# Altium project Light_Control.PrjPcb
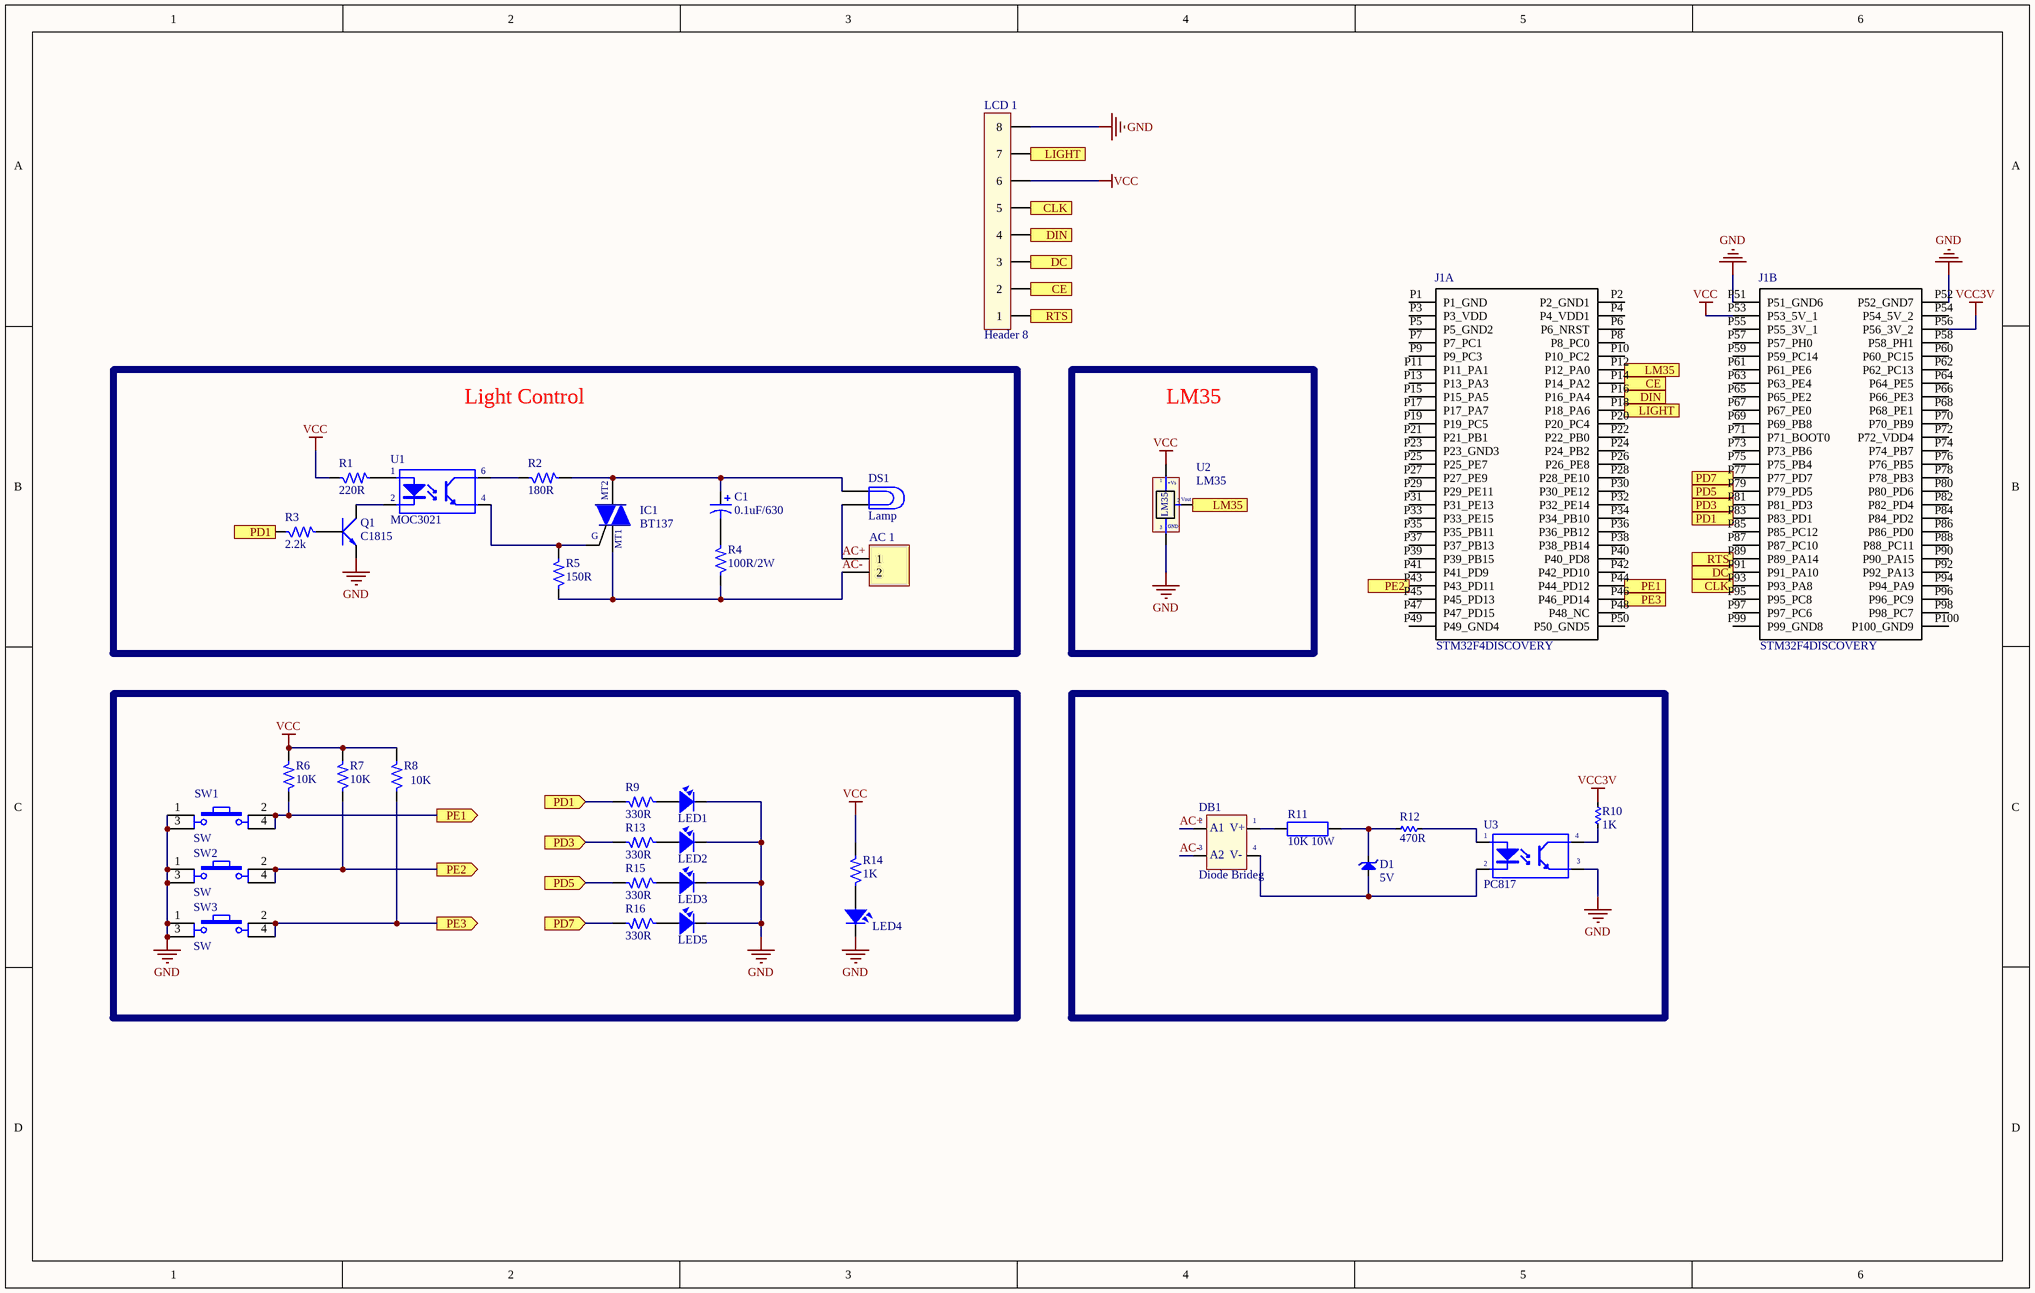
[diagram p0: Sheet1.SchDoc]
1 sheet, 36 parts. Net scope: flat (ports and power ports of the same name join across sheets).
Board file: PCB1.PcbDoc

## Sheet Sheet1.SchDoc
size B

### Parts
AC_1  Header 2  [DOMINO 2-5mm -H]  (value not drawn)
C1  value 0.1uF/630  [C-SE-22,5x26x20x11x4]
D1  5V  [DIO-0.5A-SMALL]
DB1  Diode Brideg  [DIO-Bri 5A]
DS1  Lamp  [DOMINO 2-5mm -H]
IC1  BT137  [TO220H2]
J1  STM32F4DISCOVERY  [STMICROELECTRONICS_STM32F4DISCOVERY_STM32F4DISCOVERY(Primary)]  (parts A,B of 2)
LCD_1  Header 8  [JP8]
LED1  LED  [LED_0805_Blue]  (value not drawn)
LED2  LED  [LED_0805_Blue]  (value not drawn)
LED3  LED  [LED_0805_Blue]  (value not drawn)
LED4  LED  [LED_0805_Blue]  (value not drawn)
LED5  LED  [LED_0805_Blue]  (value not drawn)
Q1  C1815  [QTO-92]
R1  220R  [RES-SM-0805]
R2  180R  [RES-SM-0805]
R3  2.2k  [RES-SM-0805]
R4  100R/2W  [R1W]
R5  150R  [RES-SM-0805]
R6  10K  [RES-SM-0805]
R7  10K  [RES-SM-0805]
R8  10K  [RES-SM-0805]
R9  330R  [RES-SM-0805]
R10  1K  [RES-SM-0805]
R11  10K 10W  [PCBComponent_1]
R12  470R  [RES-SM-0805]
R13  330R  [RES-SM-0805]
R14  1K  [RES-SM-0805]
R15  330R  [RES-SM-0805]
R16  330R  [RES-SM-0805]
SW1  SW  [SW4]
SW2  SW  [SW4]
SW3  SW  [SW4]
U1  MOC3021  [DIP6/W0.3]
U2  LM35  [QTO-92]
U3  PC817  [DIP4]

### Blocks framed on the sheet
Light Control: AC_1 C1 DS1 IC1 Q1 R1-R5 U1
LM35: U2

### Ports
CE (in), CE (out), CLK (in), CLK (out), DC (in), DC (out), DIN (in), DIN (out), LIGHT (in), LIGHT (out), LM35 (in), LM35 (out), PD1, PD1 (in), PD1 (out), PD3 (in), PD3 (out), PD5 (in), PD5 (out), PD7 (in), PD7 (out), PE1 (in), PE1 (out), PE2 (in), PE2 (out), PE3 (in), PE3 (out), RTS (in), RTS (out)

### Nets
GND: J1.P51(P51_GND6) J1.P52(P52_GND7) LCD_1.8 LED1.2 LED2.2 LED3.2 LED4.2 LED5.2 Q1.1(E) SW1.1 SW1.3 SW2.1 SW2.3 SW3.1 SW3.3 U2.3(-) U3.3(E)
VCC: J1.P53(P53_5V_1) LCD_1.6 R1.1 R6.2 R7.2 R8.2 R14.2 U2.1(+Vs)
VCC3V: J1.P56(P56_3V_2) R10.1
AC+: AC_1.1 DB1.2(AC1) DS1.2
AC-: AC_1.2 DB1.3(AC2) IC1.1(MT1) R4.1 R5.1
NetC1_1: C1.1 DS1.1 IC1.2(MT2) R2.2
NetC1_2: C1.2 R4.2
NetD1_1: D1.1(A) DB1.4(-V_OUT) U3.2(K)
NetD1_2: D1.2(K) R11.2 R12.2
NetDB1_1: DB1.1(+V_OUT) R11.1
NetIC1_3: IC1.3(IN) R5.2 U1.4(E)
NetJ1_P12: J1.P12(P12_PA0) U2.2(Vout) ; port LM35
NetJ1_P14: J1.P14(P14_PA2) LCD_1.2 ; port CE
NetJ1_P16: J1.P16(P16_PA4) LCD_1.4 ; port DIN
NetJ1_P18: J1.P18(P18_PA6) LCD_1.7 ; port LIGHT
NetJ1_P43: J1.P43(P43_PD11) R7.1 SW2.2 SW2.4 ; port PE2
NetJ1_P44: J1.P44(P44_PD12) R6.1 SW1.2 SW1.4 ; port PE1
NetJ1_P46: J1.P46(P46_PD14) R8.1 SW3.2 SW3.4 ; port PE3
NetJ1_P77: J1.P77(P77_PD7) R16.2 ; port PD7
NetJ1_P79: J1.P79(P79_PD5) R15.2 ; port PD5
NetJ1_P81: J1.P81(P81_PD3) R13.2 ; port PD3
NetJ1_P83: J1.P83(P83_PD1) R3.1 R9.2 ; port PD1
NetJ1_P89: J1.P89(P89_PA14) LCD_1.1 ; port RTS
NetJ1_P91: J1.P91(P91_PA10) LCD_1.3 ; port DC
NetJ1_P93: J1.P93(P93_PA8) LCD_1.5 ; port CLK
NetLED1_1: LED1.1 R9.1
NetLED2_1: LED2.1 R13.1
NetLED3_1: LED3.1 R15.1
NetLED4_1: LED4.1 R14.1
NetLED5_1: LED5.1 R16.1
NetQ1_2: Q1.2(C) U1.2(K)
NetQ1_3: Q1.3(B) R3.2
NetR1_2: R1.2 U1.1(A)
NetR2_1: R2.1 U1.6(C)
NetR10_2: R10.2 U3.4(C)
NetR12_1: R12.1 U3.1(A)

Not connected (* = marked no-connect by the designer): J1 P1(P1_GND) P2(P2_GND1) P3(P3_VDD) P4(P4_VDD1) P5(P5_GND2) P6(P6_NRST) P7(P7_PC1) P8(P8_PC0) P9(P9_PC3) P10(P10_PC2) P11(P11_PA1) P13(P13_PA3) P15(P15_PA5) P17(P17_PA7) P19(P19_PC5) P20(P20_PC4) P21(P21_PB1) P22(P22_PB0) P23(P23_GND3) P24(P24_PB2) P25(P25_PE7) P26(P26_PE8) P27(P27_PE9) P28(P28_PE10) P29(P29_PE11) P30(P30_PE12) P31(P31_PE13) P32(P32_PE14) P33(P33_PE15) P34(P34_PB10) P35(P35_PB11) P36(P36_PB12) P37(P37_PB13) P38(P38_PB14) P39(P39_PB15) P40(P40_PD8) P41(P41_PD9) P42(P42_PD10) P45(P45_PD13) P47(P47_PD15) P48(P48_NC) P49(P49_GND4) P50(P50_GND5) P54(P54_5V_2) P55(P55_3V_1) P57(P57_PH0) P58(P58_PH1) P59(P59_PC14) P60(P60_PC15) P61(P61_PE6) P62(P62_PC13) P63(P63_PE4) P64(P64_PE5) P65(P65_PE2) P66(P66_PE3) P67(P67_PE0) P68(P68_PE1) P69(P69_PB8) P70(P70_PB9) P71(P71_BOOT0) P72(P72_VDD4) P73(P73_PB6) P74(P74_PB7) P75(P75_PB4) P76(P76_PB5) P78(P78_PB3) P80(P80_PD6) P82(P82_PD4) P84(P84_PD2) P85(P85_PC12) P86(P86_PD0) P87(P87_PC10) P88(P88_PC11) P90(P90_PA15) P92(P92_PA13) P94(P94_PA9) P95(P95_PC8) P96(P96_PC9) P97(P97_PC6) P98(P98_PC7) P99(P99_GND8) P100(P100_GND9)

### Notes on the sheet
- Title
- Size:
- Date:
- B
- Number:
- Time:
- Revision:
- Sheet
- of
- File:
- (in symbol BT137) G
- (in symbol DIODE BRIGDE) A1; V+; A2; V-
- (in symbol LM35) GND

### Library data of the parts
AC_1 = Header 2: Header, 2-Pin; Manufacturer: Generic Components; Class: Connector; Value: Header 2
C1 = Cap Pol3: Polarized Capacitor (Surface Mount); VALUE: C?; LatestRevisionDate: 17-Jul-2002; LatestRevisionNote: Re-released for DXP Platform.; PackageReference: C0805; Publisher: Altium Limited
D1 = DIODE Zener: Zenner
DB1 = DIODE BRIGDE: Convert AC to DC voltage, 4 pin; Value: Cau 1A
DS1 = Lamp: Incandescent Bulb; Published: 24-Mar-1999; LatestRevisionDate: 17-Jul-2002; LatestRevisionNote: Re-released for DXP Platform.; PackageReference: PIN2; Publisher: Altium Limited
IC1 = BT137: Triacs - 8A; Value: LM317
J1 = STM32F4DISCOVERY: Development kit: ARM ST; pin strips, pin header; No.of; MF: STMicroelectronics; Price: None; SnapEDA_Link: https://www.snapeda.com/symbols-footprints/STM32F4DISCOVERY/STMicroelectronics/view-part/?ref=snap; Availability: Unavailable; MP: STM32F4DISCOVERY; Package: None; Value: *
LCD_1 = HED8V: Header 8 Vit Broad
LED1-LED5 = LED: LED Single colour Green and Red; Value: LED 3 ly Single Colour
Q1 = C1815: NPN 600mW, ECB; Value: C1815
R1-R9 R13-R16 = R: Resistor 1/4W; Value: R1/4W - 1K
R10 R12 = Res: Manufacturer: Generic Components; Class: Passive; SubClass: R; Published: 08/06/2000; Publisher: Altium Hobart Technology Centre
R11 = Res 10 W: 10W Res Power; Creator: Nguyen Ba Bien
SW1-SW3 = SW4: Switch button 4 pin; Value: Button chip 4 pin
U1 = MOC3021: Single Opto; Value: MOC3021
U2 = LM35: Teminal; Value: LM35
U3 = PC817: Single Opto; Value: PC817